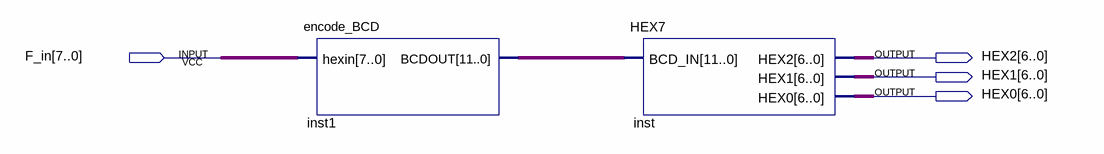
[diagram p0: schematic sheet]
// Quartus schematic BCD_HEX.bdf as structural Verilog: 2 symbols, 4 pins
module BCD_HEX (
  input  [7:0] F_in,
  output [6:0] HEX2,
  output [6:0] HEX1,
  output [6:0] HEX0
);

  wire [11:0] inst1_bcdout;

  encode_BCD inst1 (.hexin(F_in), .BCDOUT(inst1_bcdout));
  HEX7 inst (.BCD_IN(inst1_bcdout), .HEX2(HEX2), .HEX1(HEX1), .HEX0(HEX0));
endmodule
